# EAGLE schematic BT60-Test-jig (EAGLE 9.6.2)
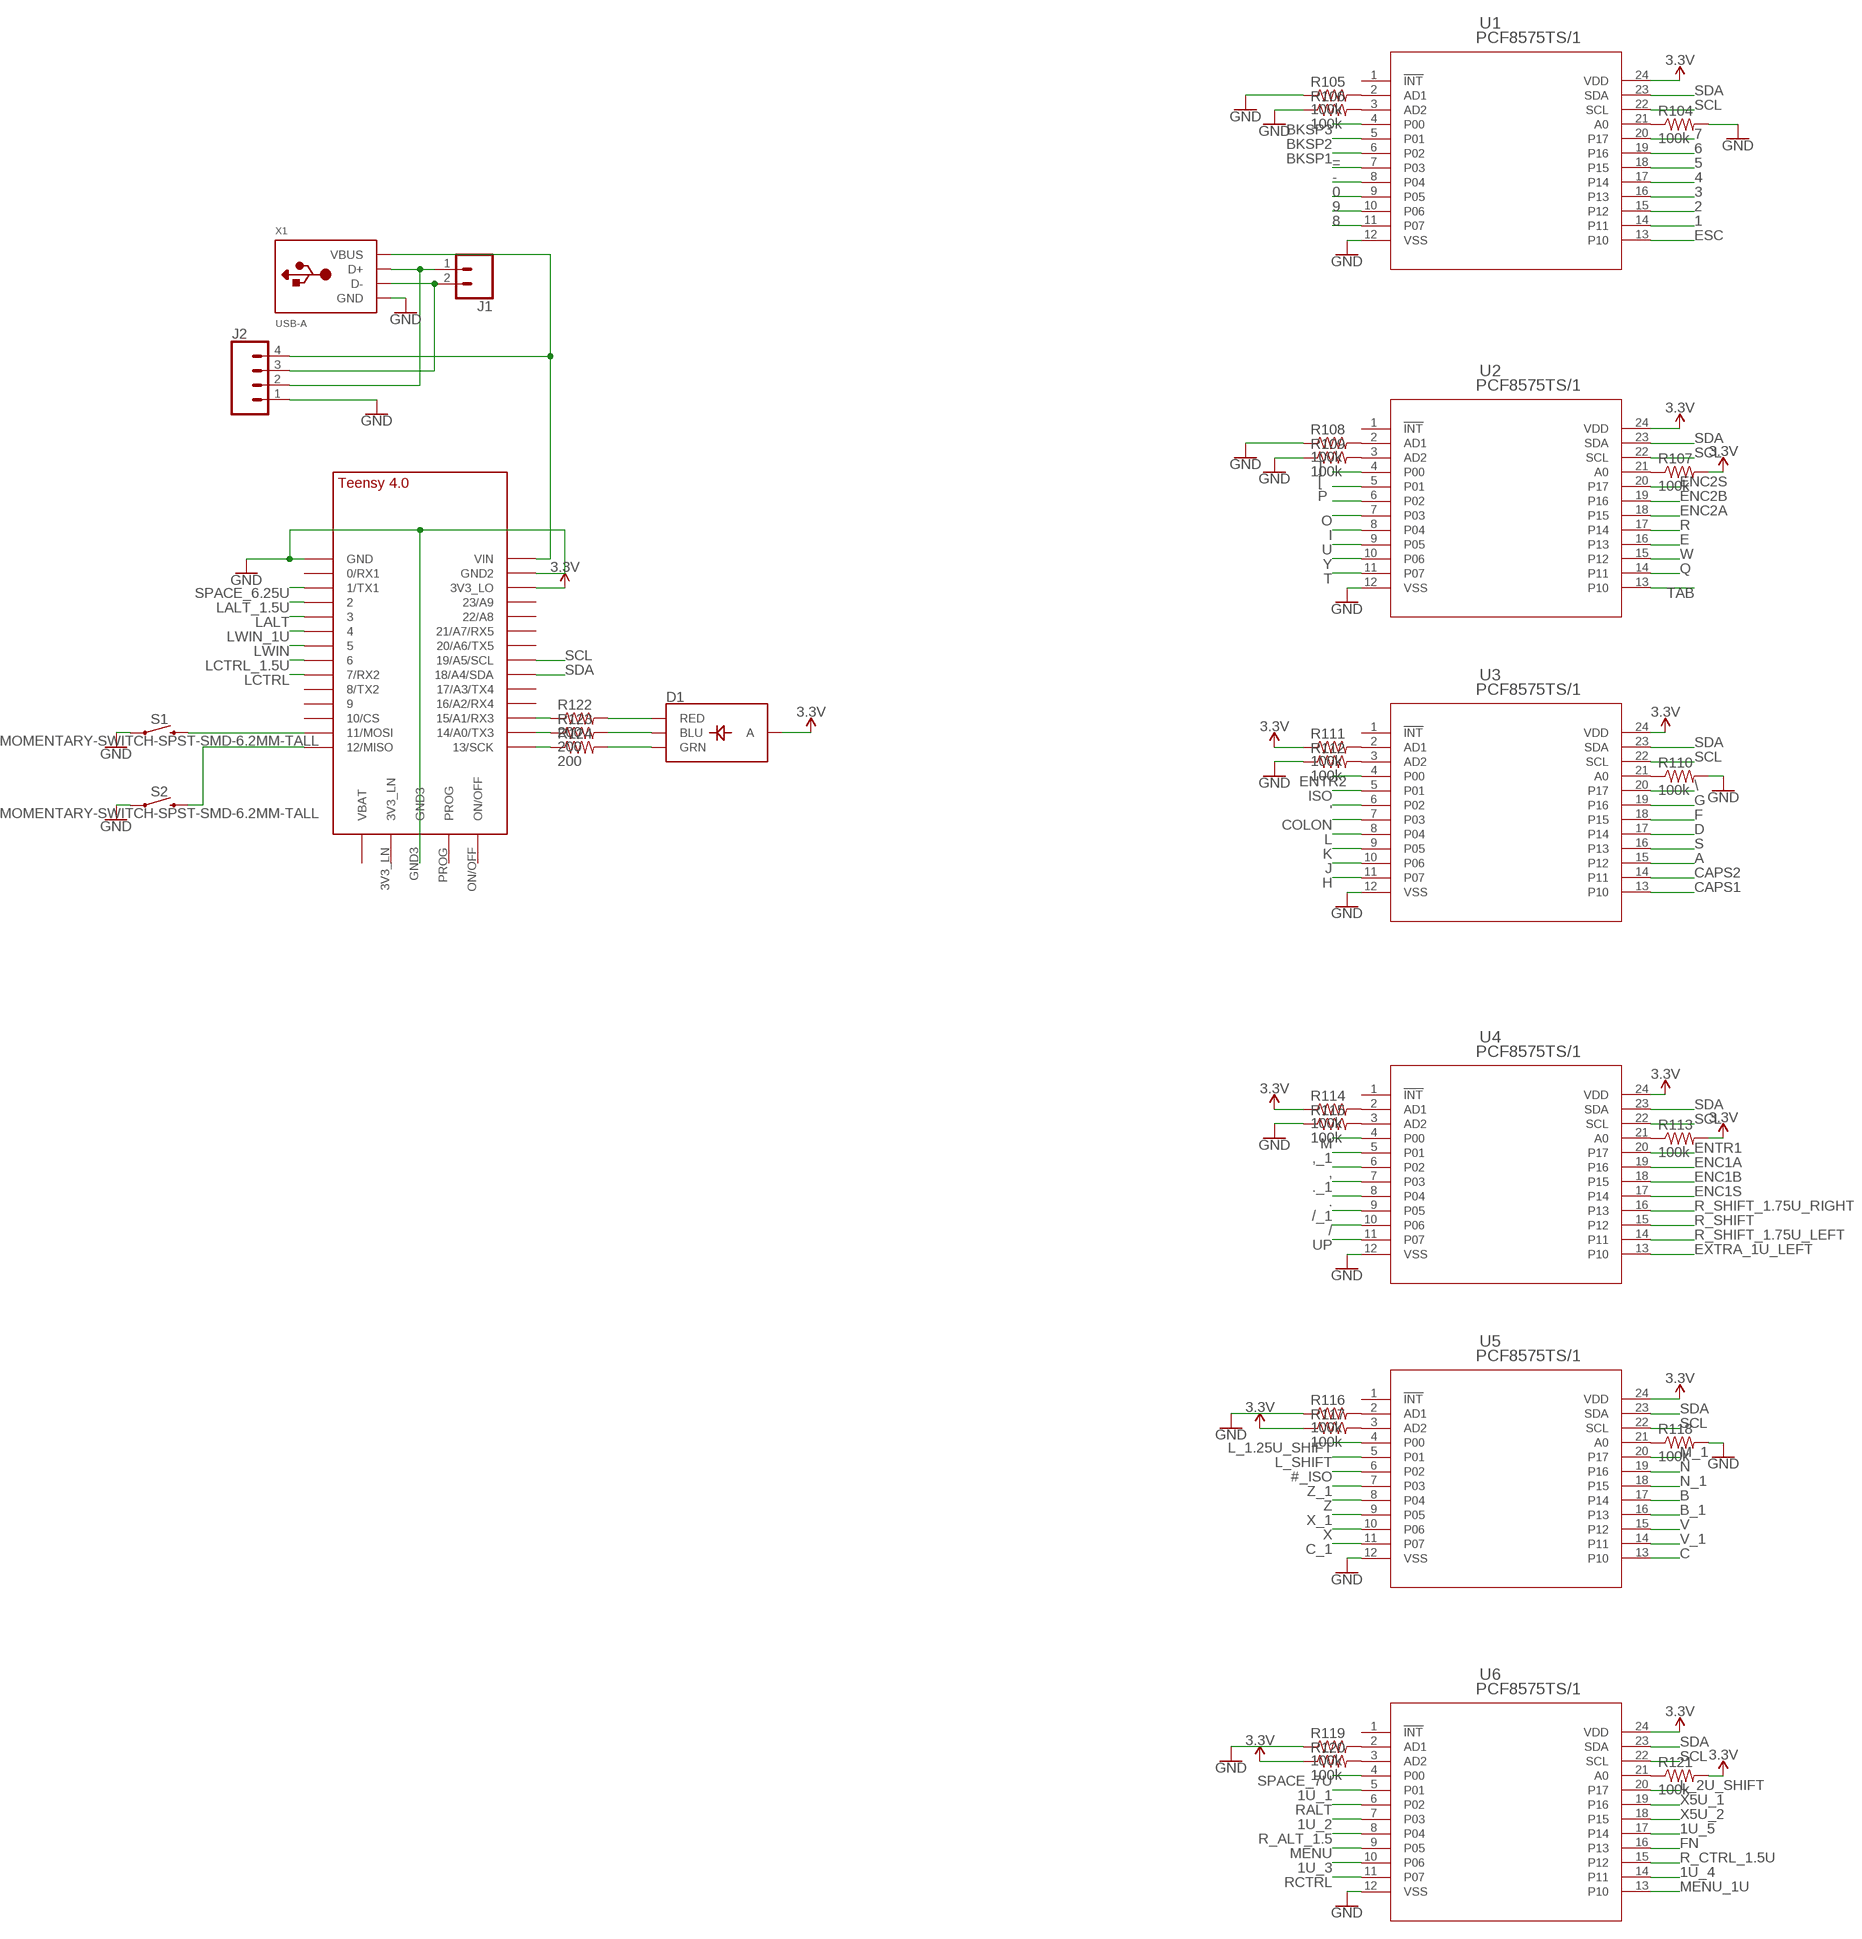
[diagram p0: schematic, sheet 1, part 1 of 2]
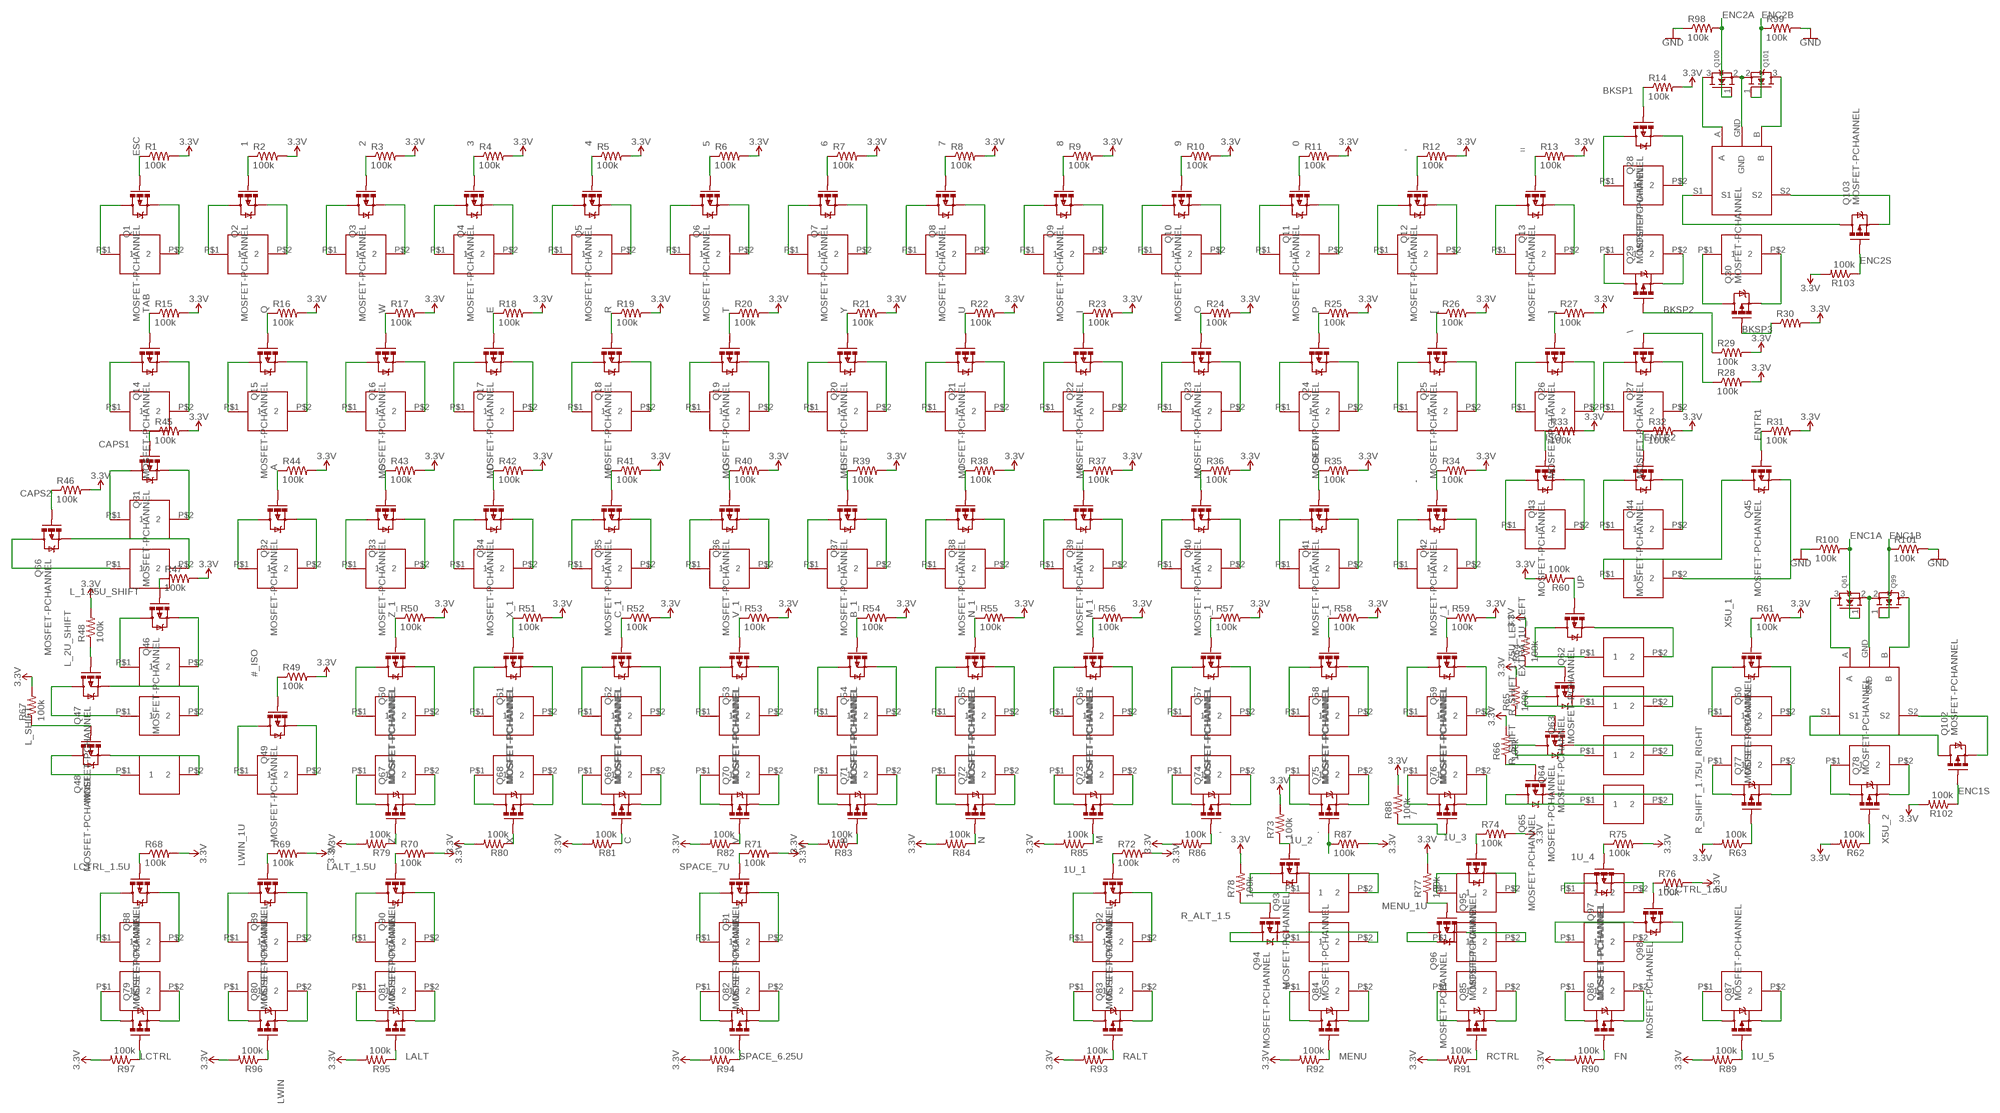
[diagram p1: schematic, sheet 1, part 2 of 2]

## Parts
0  CHERRY-SOLDERCHERRY-TEST  [CHERRY-TEST]
1  CHERRY-SOLDERCHERRY-TEST  [CHERRY-TEST]
1U_1  CHERRY-SOLDERCHERRY-TEST  [CHERRY-TEST]
1U_2  CHERRY-SOLDERCHERRY-TEST  [CHERRY-TEST]
1U_3  CHERRY-SOLDERCHERRY-TEST  [CHERRY-TEST]
1U_4  CHERRY-SOLDERCHERRY-TEST  [CHERRY-TEST]
1U_5  CHERRY-SOLDERCHERRY-TEST  [CHERRY-TEST]
2  CHERRY-SOLDERCHERRY-TEST  [CHERRY-TEST]
3  CHERRY-SOLDERCHERRY-TEST  [CHERRY-TEST]
4  CHERRY-SOLDERCHERRY-TEST  [CHERRY-TEST]
5  CHERRY-SOLDERCHERRY-TEST  [CHERRY-TEST]
6  CHERRY-SOLDERCHERRY-TEST  [CHERRY-TEST]
7  CHERRY-SOLDERCHERRY-TEST  [CHERRY-TEST]
8  CHERRY-SOLDERCHERRY-TEST  [CHERRY-TEST]
9  CHERRY-SOLDERCHERRY-TEST  [CHERRY-TEST]
#_ISO  CHERRY-SOLDERCHERRY-TEST  [CHERRY-TEST]
'  CHERRY-SOLDERCHERRY-TEST  [CHERRY-TEST]
,  CHERRY-SOLDERCHERRY-TEST  [CHERRY-TEST]
,_1  CHERRY-SOLDERCHERRY-TEST  [CHERRY-TEST]
-  CHERRY-SOLDERCHERRY-TEST  [CHERRY-TEST]
.  CHERRY-SOLDERCHERRY-TEST  [CHERRY-TEST]
._1  CHERRY-SOLDERCHERRY-TEST  [CHERRY-TEST]
/  CHERRY-SOLDERCHERRY-TEST  [CHERRY-TEST]
/_1  CHERRY-SOLDERCHERRY-TEST  [CHERRY-TEST]
=  CHERRY-SOLDERCHERRY-TEST  [CHERRY-TEST]
[  CHERRY-SOLDERCHERRY-TEST  [CHERRY-TEST]
\  CHERRY-SOLDERCHERRY-TEST  [CHERRY-TEST]
]  CHERRY-SOLDERCHERRY-TEST  [CHERRY-TEST]
A  CHERRY-SOLDERCHERRY-TEST  [CHERRY-TEST]
B  CHERRY-SOLDERCHERRY-TEST  [CHERRY-TEST]
B_1  CHERRY-SOLDERCHERRY-TEST  [CHERRY-TEST]
BS  CHERRY-SOLDERCHERRY-TEST  [CHERRY-TEST]
C  CHERRY-SOLDERCHERRY-TEST  [CHERRY-TEST]
C_1  CHERRY-SOLDERCHERRY-TEST  [CHERRY-TEST]
CAPS  CHERRY-SOLDERCHERRY-TEST  [CHERRY-TEST]
CAPS_STEP  CHERRY-SOLDERCHERRY-TEST  [CHERRY-TEST]
COLON  CHERRY-SOLDERCHERRY-TEST  [CHERRY-TEST]
D  CHERRY-SOLDERCHERRY-TEST  [CHERRY-TEST]
D1  LED-RGB-CASMD  [LED-TRICOLOR-SMD]
E  CHERRY-SOLDERCHERRY-TEST  [CHERRY-TEST]
ENTER  CHERRY-SOLDERCHERRY-TEST  [CHERRY-TEST]
ESC  CHERRY-SOLDERCHERRY-TEST  [CHERRY-TEST]
EXTRA_1U_LEFT  CHERRY-SOLDERCHERRY-TEST  [CHERRY-TEST]
F  CHERRY-SOLDERCHERRY-TEST  [CHERRY-TEST]
FN  CHERRY-SOLDERCHERRY-TEST  [CHERRY-TEST]
G  CHERRY-SOLDERCHERRY-TEST  [CHERRY-TEST]
H  CHERRY-SOLDERCHERRY-TEST  [CHERRY-TEST]
I  CHERRY-SOLDERCHERRY-TEST  [CHERRY-TEST]
ISO_#  CHERRY-SOLDERCHERRY-TEST  [CHERRY-TEST]
ISO_ENTER  CHERRY-SOLDERCHERRY-TEST  [CHERRY-TEST]
J  CHERRY-SOLDERCHERRY-TEST  [CHERRY-TEST]
J1  CONN_02  [1X02]
J2  CONN_041X04_NO_SILK  [1X04_NO_SILK]
K  CHERRY-SOLDERCHERRY-TEST  [CHERRY-TEST]
L  CHERRY-SOLDERCHERRY-TEST  [CHERRY-TEST]
L_1.25U_SHIFT  CHERRY-SOLDERCHERRY-TEST  [CHERRY-TEST]
L_2U_SHIFT  CHERRY-SOLDERCHERRY-TEST  [CHERRY-TEST]
L_SHIFT  CHERRY-SOLDERCHERRY-TEST  [CHERRY-TEST]
LALT  CHERRY-SOLDERCHERRY-TEST  [CHERRY-TEST]
LALT_1.5U  CHERRY-SOLDERCHERRY-TEST  [CHERRY-TEST]
LCTRL  CHERRY-SOLDERCHERRY-TEST  [CHERRY-TEST]
LCTRL_1.5U  CHERRY-SOLDERCHERRY-TEST  [CHERRY-TEST]
LWIN  CHERRY-SOLDERCHERRY-TEST  [CHERRY-TEST]
LWIN_1U  CHERRY-SOLDERCHERRY-TEST  [CHERRY-TEST]
M  CHERRY-SOLDERCHERRY-TEST  [CHERRY-TEST]
M_1  CHERRY-SOLDERCHERRY-TEST  [CHERRY-TEST]
MENU  CHERRY-SOLDERCHERRY-TEST  [CHERRY-TEST]
MENU_1U  CHERRY-SOLDERCHERRY-TEST  [CHERRY-TEST]
N  CHERRY-SOLDERCHERRY-TEST  [CHERRY-TEST]
N_1  CHERRY-SOLDERCHERRY-TEST  [CHERRY-TEST]
O  CHERRY-SOLDERCHERRY-TEST  [CHERRY-TEST]
P  CHERRY-SOLDERCHERRY-TEST  [CHERRY-TEST]
Q  CHERRY-SOLDERCHERRY-TEST  [CHERRY-TEST]
Q1  MOSFET-PCHANNEL  [SOT23-3]
Q2  MOSFET-PCHANNEL  [SOT23-3]
Q3  MOSFET-PCHANNEL  [SOT23-3]
Q4  MOSFET-PCHANNEL  [SOT23-3]
Q5  MOSFET-PCHANNEL  [SOT23-3]
Q6  MOSFET-PCHANNEL  [SOT23-3]
Q7  MOSFET-PCHANNEL  [SOT23-3]
Q8  MOSFET-PCHANNEL  [SOT23-3]
Q9  MOSFET-PCHANNEL  [SOT23-3]
Q10  MOSFET-PCHANNEL  [SOT23-3]
Q11  MOSFET-PCHANNEL  [SOT23-3]
Q12  MOSFET-PCHANNEL  [SOT23-3]
Q13  MOSFET-PCHANNEL  [SOT23-3]
Q14  MOSFET-PCHANNEL  [SOT23-3]
Q15  MOSFET-PCHANNEL  [SOT23-3]
Q16  MOSFET-PCHANNEL  [SOT23-3]
Q17  MOSFET-PCHANNEL  [SOT23-3]
Q18  MOSFET-PCHANNEL  [SOT23-3]
Q19  MOSFET-PCHANNEL  [SOT23-3]
Q20  MOSFET-PCHANNEL  [SOT23-3]
Q21  MOSFET-PCHANNEL  [SOT23-3]
Q22  MOSFET-PCHANNEL  [SOT23-3]
Q23  MOSFET-PCHANNEL  [SOT23-3]
Q24  MOSFET-PCHANNEL  [SOT23-3]
Q25  MOSFET-PCHANNEL  [SOT23-3]
Q26  MOSFET-PCHANNEL  [SOT23-3]
Q27  MOSFET-PCHANNEL  [SOT23-3]
Q28  MOSFET-PCHANNEL  [SOT23-3]
Q29  MOSFET-PCHANNEL  [SOT23-3]
Q30  MOSFET-PCHANNEL  [SOT23-3]
Q31  MOSFET-PCHANNEL  [SOT23-3]
Q32  MOSFET-PCHANNEL  [SOT23-3]
Q33  MOSFET-PCHANNEL  [SOT23-3]
Q34  MOSFET-PCHANNEL  [SOT23-3]
Q35  MOSFET-PCHANNEL  [SOT23-3]
Q36  MOSFET-PCHANNEL  [SOT23-3]
Q37  MOSFET-PCHANNEL  [SOT23-3]
Q38  MOSFET-PCHANNEL  [SOT23-3]
Q39  MOSFET-PCHANNEL  [SOT23-3]
Q40  MOSFET-PCHANNEL  [SOT23-3]
Q41  MOSFET-PCHANNEL  [SOT23-3]
Q42  MOSFET-PCHANNEL  [SOT23-3]
Q43  MOSFET-PCHANNEL  [SOT23-3]
Q44  MOSFET-PCHANNEL  [SOT23-3]
Q45  MOSFET-PCHANNEL  [SOT23-3]
Q46  MOSFET-PCHANNEL  [SOT23-3]
Q47  MOSFET-PCHANNEL  [SOT23-3]
Q48  MOSFET-PCHANNEL  [SOT23-3]
Q49  MOSFET-PCHANNEL  [SOT23-3]
Q50  MOSFET-PCHANNEL  [SOT23-3]
Q51  MOSFET-PCHANNEL  [SOT23-3]
Q52  MOSFET-PCHANNEL  [SOT23-3]
Q53  MOSFET-PCHANNEL  [SOT23-3]
Q54  MOSFET-PCHANNEL  [SOT23-3]
Q55  MOSFET-PCHANNEL  [SOT23-3]
Q56  MOSFET-PCHANNEL  [SOT23-3]
Q57  MOSFET-PCHANNEL  [SOT23-3]
Q58  MOSFET-PCHANNEL  [SOT23-3]
Q59  MOSFET-PCHANNEL  [SOT23-3]
Q60  MOSFET-PCHANNEL  [SOT23-3]
Q61  MOSFET-NREFLOW  [SOT23]
Q62  MOSFET-PCHANNEL  [SOT23-3]
Q63  MOSFET-PCHANNEL  [SOT23-3]
Q64  MOSFET-PCHANNEL  [SOT23-3]
Q65  MOSFET-PCHANNEL  [SOT23-3]
Q66  MOSFET-PCHANNEL  [SOT23-3]
Q67  MOSFET-PCHANNEL  [SOT23-3]
Q68  MOSFET-PCHANNEL  [SOT23-3]
Q69  MOSFET-PCHANNEL  [SOT23-3]
Q70  MOSFET-PCHANNEL  [SOT23-3]
Q71  MOSFET-PCHANNEL  [SOT23-3]
Q72  MOSFET-PCHANNEL  [SOT23-3]
Q73  MOSFET-PCHANNEL  [SOT23-3]
Q74  MOSFET-PCHANNEL  [SOT23-3]
Q75  MOSFET-PCHANNEL  [SOT23-3]
Q76  MOSFET-PCHANNEL  [SOT23-3]
Q77  MOSFET-PCHANNEL  [SOT23-3]
Q78  MOSFET-PCHANNEL  [SOT23-3]
Q79  MOSFET-PCHANNEL  [SOT23-3]
Q80  MOSFET-PCHANNEL  [SOT23-3]
Q81  MOSFET-PCHANNEL  [SOT23-3]
Q82  MOSFET-PCHANNEL  [SOT23-3]
Q83  MOSFET-PCHANNEL  [SOT23-3]
Q84  MOSFET-PCHANNEL  [SOT23-3]
Q85  MOSFET-PCHANNEL  [SOT23-3]
Q86  MOSFET-PCHANNEL  [SOT23-3]
Q87  MOSFET-PCHANNEL  [SOT23-3]
Q88  MOSFET-PCHANNEL  [SOT23-3]
Q89  MOSFET-PCHANNEL  [SOT23-3]
Q90  MOSFET-PCHANNEL  [SOT23-3]
Q91  MOSFET-PCHANNEL  [SOT23-3]
Q92  MOSFET-PCHANNEL  [SOT23-3]
Q93  MOSFET-PCHANNEL  [SOT23-3]
Q94  MOSFET-PCHANNEL  [SOT23-3]
Q95  MOSFET-PCHANNEL  [SOT23-3]
Q96  MOSFET-PCHANNEL  [SOT23-3]
Q97  MOSFET-PCHANNEL  [SOT23-3]
Q98  MOSFET-PCHANNEL  [SOT23-3]
Q99  MOSFET-NREFLOW  [SOT23]
Q100  MOSFET-NREFLOW  [SOT23]
Q101  MOSFET-NREFLOW  [SOT23]
Q102  MOSFET-PCHANNEL  [SOT23-3]
Q103  MOSFET-PCHANNEL  [SOT23-3]
R  CHERRY-SOLDERCHERRY-TEST  [CHERRY-TEST]
R1  100k  R0603  [0603-R]
R2  100k  R0603  [0603-R]
R3  100k  R0603  [0603-R]
R4  100k  R0603  [0603-R]
R5  100k  R0603  [0603-R]
R6  100k  R0603  [0603-R]
R7  100k  R0603  [0603-R]
R8  100k  R0603  [0603-R]
R9  100k  R0603  [0603-R]
R10  100k  R0603  [0603-R]
R11  100k  R0603  [0603-R]
R12  100k  R0603  [0603-R]
R13  100k  R0603  [0603-R]
R14  100k  R0603  [0603-R]
R15  100k  R0603  [0603-R]
R16  100k  R0603  [0603-R]
R17  100k  R0603  [0603-R]
R18  100k  R0603  [0603-R]
R19  100k  R0603  [0603-R]
R20  100k  R0603  [0603-R]
R21  100k  R0603  [0603-R]
R22  100k  R0603  [0603-R]
R23  100k  R0603  [0603-R]
R24  100k  R0603  [0603-R]
R25  100k  R0603  [0603-R]
R26  100k  R0603  [0603-R]
R27  100k  R0603  [0603-R]
R28  100k  R0603  [0603-R]
R29  100k  R0603  [0603-R]
R30  100k  R0603  [0603-R]
R31  100k  R0603  [0603-R]
R32  100k  R0603  [0603-R]
R33  100k  R0603  [0603-R]
R34  100k  R0603  [0603-R]
R35  100k  R0603  [0603-R]
R36  100k  R0603  [0603-R]
R37  100k  R0603  [0603-R]
R38  100k  R0603  [0603-R]
R39  100k  R0603  [0603-R]
R40  100k  R0603  [0603-R]
R41  100k  R0603  [0603-R]
R42  100k  R0603  [0603-R]
R43  100k  R0603  [0603-R]
R44  100k  R0603  [0603-R]
R45  100k  R0603  [0603-R]
R46  100k  R0603  [0603-R]
R47  100k  R0603  [0603-R]
R48  100k  R0603  [0603-R]
R49  100k  R0603  [0603-R]
R50  100k  R0603  [0603-R]
R51  100k  R0603  [0603-R]
R52  100k  R0603  [0603-R]
R53  100k  R0603  [0603-R]
R54  100k  R0603  [0603-R]
R55  100k  R0603  [0603-R]
R56  100k  R0603  [0603-R]
R57  100k  R0603  [0603-R]
R58  100k  R0603  [0603-R]
R59  100k  R0603  [0603-R]
R60  100k  R0603  [0603-R]
R61  100k  R0603  [0603-R]
R62  100k  R0603  [0603-R]
R63  100k  R0603  [0603-R]
R64  100k  R0603  [0603-R]
R65  100k  R0603  [0603-R]
R66  100k  R0603  [0603-R]
R67  100k  R0603  [0603-R]
R68  100k  R0603  [0603-R]
R69  100k  R0603  [0603-R]
R70  100k  R0603  [0603-R]
R71  100k  R0603  [0603-R]
R72  100k  R0603  [0603-R]
R73  100k  R0603  [0603-R]
R74  100k  R0603  [0603-R]
R75  100k  R0603  [0603-R]
R76  100k  R0603  [0603-R]
R77  100k  R0603  [0603-R]
R78  100k  R0603  [0603-R]
R79  100k  R0603  [0603-R]
R80  100k  R0603  [0603-R]
R81  100k  R0603  [0603-R]
R82  100k  R0603  [0603-R]
R83  100k  R0603  [0603-R]
R84  100k  R0603  [0603-R]
R85  100k  R0603  [0603-R]
R86  100k  R0603  [0603-R]
R87  100k  R0603  [0603-R]
R88  100k  R0603  [0603-R]
R89  100k  R0603  [0603-R]
R90  100k  R0603  [0603-R]
R91  100k  R0603  [0603-R]
R92  100k  R0603  [0603-R]
R93  100k  R0603  [0603-R]
R94  100k  R0603  [0603-R]
R95  100k  R0603  [0603-R]
R96  100k  R0603  [0603-R]
R97  100k  R0603  [0603-R]
R98  100k  R0603  [0603-R]
R99  100k  R0603  [0603-R]
R100  100k  R0603  [0603-R]
R101  100k  R0603  [0603-R]
R102  100k  R0603  [0603-R]
R103  100k  R0603  [0603-R]
R104  100k  R0603  [0603-R]
R105  100k  R0603  [0603-R]
R106  100k  R0603  [0603-R]
R107  100k  R0603  [0603-R]
R108  100k  R0603  [0603-R]
R109  100k  R0603  [0603-R]
R110  100k  R0603  [0603-R]
R111  100k  R0603  [0603-R]
R112  100k  R0603  [0603-R]
R113  100k  R0603  [0603-R]
R114  100k  R0603  [0603-R]
R115  100k  R0603  [0603-R]
R116  100k  R0603  [0603-R]
R117  100k  R0603  [0603-R]
R118  100k  R0603  [0603-R]
R119  100k  R0603  [0603-R]
R120  100k  R0603  [0603-R]
R121  100k  R0603  [0603-R]
R122  200  R0603  [0603-R]
R123  200  R0603  [0603-R]
R124  200  R0603  [0603-R]
R_ALT_1.5  CHERRY-SOLDERCHERRY-TEST  [CHERRY-TEST]
R_CTRL_1.5U  CHERRY-SOLDERCHERRY-TEST  [CHERRY-TEST]
R_SHIFT  CHERRY-SOLDERCHERRY-TEST  [CHERRY-TEST]
R_SHIFT_1.75U_LEFT  CHERRY-SOLDERCHERRY-TEST  [CHERRY-TEST]
R_SHIFT_1.75U_RIGHT  CHERRY-SOLDERCHERRY-TEST  [CHERRY-TEST]
RALT  CHERRY-SOLDERCHERRY-TEST  [CHERRY-TEST]
RCTRL  CHERRY-SOLDERCHERRY-TEST  [CHERRY-TEST]
S  CHERRY-SOLDERCHERRY-TEST  [CHERRY-TEST]
S1  MOMENTARY-SWITCH-SPST-SMD-6.2MM-TALL  [TACTILE_SWITCH_SMD_6.2MM_TALL]
S2  MOMENTARY-SWITCH-SPST-SMD-6.2MM-TALL  [TACTILE_SWITCH_SMD_6.2MM_TALL]
SPACE_6.25U  CHERRY-SOLDERCHERRY-TEST  [CHERRY-TEST]
SPACE_7U  CHERRY-SOLDERCHERRY-TEST  [CHERRY-TEST]
SPLIT_BS_1  CHERRY-SOLDERCHERRY-TEST  [CHERRY-TEST]
SPLIT_BS_2  CHERRY-SOLDERCHERRY-TEST  [CHERRY-TEST]
T  CHERRY-SOLDERCHERRY-TEST  [CHERRY-TEST]
TAB  CHERRY-SOLDERCHERRY-TEST  [CHERRY-TEST]
U  CHERRY-SOLDERCHERRY-TEST  [CHERRY-TEST]
U1  PCF8575TS/1  [SOT340-1_NXP]
U2  PCF8575TS/1  [SOT340-1_NXP]
U3  PCF8575TS/1  [SOT340-1_NXP]
U4  PCF8575TS/1  [SOT340-1_NXP]
U5  PCF8575TS/1  [SOT340-1_NXP]
U6  PCF8575TS/1  [SOT340-1_NXP]
U$1  ENCODER  [ENCODER]
U$2  TEENSY_4.0  [TEENSY_4.0]
U$3  ENCODER  [ENCODER]
UP  CHERRY-SOLDERCHERRY-TEST  [CHERRY-TEST]
V  CHERRY-SOLDERCHERRY-TEST  [CHERRY-TEST]
V_1  CHERRY-SOLDERCHERRY-TEST  [CHERRY-TEST]
W  CHERRY-SOLDERCHERRY-TEST  [CHERRY-TEST]
X  CHERRY-SOLDERCHERRY-TEST  [CHERRY-TEST]
X1  USB-A  [MOLEX_480371000]
X5U_1  CHERRY-SOLDERCHERRY-TEST  [CHERRY-TEST]
X5U_2  CHERRY-SOLDERCHERRY-TEST  [CHERRY-TEST]
X_1  CHERRY-SOLDERCHERRY-TEST  [CHERRY-TEST]
Y  CHERRY-SOLDERCHERRY-TEST  [CHERRY-TEST]
Z  CHERRY-SOLDERCHERRY-TEST  [CHERRY-TEST]
Z_1  CHERRY-SOLDERCHERRY-TEST  [CHERRY-TEST]

## Nets
0: Q11.1(G) R11.1 U1.9(P05)
1: Q2.1(G) R2.1 U1.14(P11)
1U_1: Q92.1(G) R72.1 U6.5(P01)
1U_2: Q93.1(G) R73.1 U6.7(P03)
1U_3: Q95.1(G) R74.1 U6.10(P06)
1U_4: Q97.1(G) R75.1 U6.14(P11)
1U_5: Q87.1(G) R89.1 U6.17(P14)
2: Q3.1(G) R3.1 U1.15(P12)
3: Q4.1(G) R4.1 U1.16(P13)
3.3V: D1.A R1.2 R2.2 R3.2 R4.2 R5.2 R6.2 R7.2 R8.2 R9.2 R10.2 R11.2 R12.2 R13.2 R14.2 R15.2 R16.2 R17.2 R18.2 R19.2 R20.2 R21.2 R22.2 R23.2 R24.2 R25.2 R26.2 R27.2 R28.2 R29.2 R30.2 R31.2 R32.2 R33.2 R34.2 R35.2 R36.2 R37.2 R38.2 R39.2 R40.2 R41.2 R42.2 R43.2 R44.2 R45.2 R46.2 R47.2 R48.2 R49.2 R50.2 R51.2 R52.2 R53.2 R54.2 R55.2 R56.2 R57.2 R58.2 R59.2 R60.2 R61.2 R62.2 R63.2 R64.2 R65.2 R66.2 R67.2 R68.2 R69.2 R70.2 R71.2 R72.2 R73.2 R74.2 R75.2 R76.2 R77.2 R78.2 R79.2 R80.2 R81.2 R82.2 R83.2 R84.2 R85.2 R86.2 R87.2 R88.2 R89.2 R90.2 R91.2 R92.2 R93.2 R94.2 R95.2 R96.2 R97.2 R102.2 R103.2 R107.2 R111.1 R113.2 R114.1 R117.1 R120.1 R121.2 U1.24(VDD) U2.24(VDD) U3.24(VDD) U4.24(VDD) U5.24(VDD) U6.24(VDD) U$2.3V3_LO
4: Q5.1(G) R5.1 U1.17(P14)
5: Q6.1(G) R6.1 U1.18(P15)
6: Q7.1(G) R7.1 U1.19(P16)
7: Q8.1(G) R8.1 U1.20(P17)
8: Q9.1(G) R9.1 U1.11(P07)
9: Q10.1(G) R10.1 U1.10(P06)
#_ISO: Q49.1(G) R49.1 U5.6(P02)
': Q42.1(G) R34.1 U3.6(P02)
,: Q74.1(G) R86.1 U4.6(P02)
,_1: Q57.1(G) R57.1 U4.5(P01)
-: Q12.1(G) R12.1 U1.8(P04)
.: Q75.1(G) R87.1 U4.8(P04)
._1: Q58.1(G) R58.1 U4.7(P03)
/: Q76.1(G) R88.1 U4.10(P06)
/_1: Q59.1(G) R59.1 U4.9(P05)
=: Q13.1(G) R13.1 U1.7(P03)
[: Q25.1(G) R26.1 U2.5(P01)
\: Q27.1(G) R28.1 U3.20(P17)
]: Q26.1(G) R27.1 U2.4(P00)
A: Q32.1(G) R44.1 U3.15(P12)
B: Q71.1(G) R83.1 U5.17(P14)
B_1: Q54.1(G) R54.1 U5.16(P13)
BKSP1: Q28.1(G) R14.1 U1.6(P02)
BKSP2: Q29.1(G) R29.1 U1.5(P01)
BKSP3: Q30.1(G) R30.1 U1.4(P00)
C: Q69.1(G) R81.1 U5.13(P10)
C_1: Q52.1(G) R52.1 U5.11(P07)
CAPS1: Q31.1(G) R45.1 U3.13(P10)
CAPS2: Q66.1(G) R46.1 U3.14(P11)
COLON: Q41.1(G) R35.1 U3.7(P03)
D: Q34.1(G) R42.1 U3.17(P14)
E: Q17.1(G) R18.1 U2.16(P13)
ENC1A: Q61.1(G) R100.2 U4.19(P16)
ENC1B: Q99.1(G) R101.1 U4.18(P15)
ENC1S: Q102.1(G) R102.1 U4.17(P14)
ENC2A: Q100.1(G) R98.2 U2.18(P15)
ENC2B: Q101.1(G) R99.1 U2.19(P16)
ENC2S: Q103.1(G) R103.1 U2.20(P17)
ENTR1: Q45.1(G) R31.1 U4.20(P17)
ENTR2: Q44.1(G) R32.1 U3.4(P00)
ESC: Q1.1(G) R1.1 U1.13(P10)
EXTRA_1U_LEFT: Q63.1(G) R64.1 U4.13(P10)
F: Q35.1(G) R41.1 U3.18(P15)
FN: Q86.1(G) R90.1 U6.16(P13)
G: Q36.1(G) R40.1 U3.19(P16)
GND: J2.1 R98.1 R99.2 R100.1 R101.2 R104.2 R105.1 R106.1 R108.1 R109.1 R110.2 R112.1 R115.1 R116.1 R118.2 R119.1 S1.A2 S2.A2 U1.12(VSS) U2.12(VSS) U3.12(VSS) U4.12(VSS) U5.12(VSS) U6.12(VSS) U$2.GND U$2.GND2 U$2.GND3 X1.4(GND)
H: Q37.1(G) R39.1 U3.11(P07)
I: Q22.1(G) R23.1 U2.8(P04)
ISO: Q43.1(G) R33.1 U3.5(P01)
J: Q38.1(G) R38.1 U3.10(P06)
K: Q39.1(G) R37.1 U3.9(P05)
L: Q40.1(G) R36.1 U3.8(P04)
L_1.25U_SHIFT: Q46.1(G) R47.1 U5.4(P00)
L_2U_SHIFT: Q47.1(G) R48.1 U6.20(P17)
L_SHIFT: Q48.1(G) R67.1 U5.5(P01)
LALT: Q81.1(G) R95.1 U$2.3/CANTX
LALT_1.5U: Q90.1(G) R70.1 U$2.2
LCTRL: Q79.1(G) R97.1 U$2.7(7/RX2)
LCTRL_1.5U: Q88.1(G) R68.1 U$2.6
LWIN: Q80.1(G) R96.1 U$2.5
LWIN_1U: Q89.1(G) R69.1 U$2.4/CANRX
M: Q73.1(G) R85.1 U4.4(P00)
M_1: Q56.1(G) R56.1 U5.20(P17)
MENU: Q84.1(G) R92.1 U6.9(P05)
MENU_1U: Q96.1(G) R77.1 U6.13(P10)
N: Q72.1(G) R84.1 U5.19(P16)
N$1: ESC.P$1 Q1.3(D)
N$2: ESC.P$2 Q1.2(S)
N$3: 1.P$1 Q2.3(D)
N$4: 1.P$2 Q2.2(S)
N$5: 2.P$1 Q3.3(D)
N$6: 2.P$2 Q3.2(S)
N$7: 3.P$1 Q4.3(D)
N$8: 3.P$2 Q4.2(S)
N$9: 4.P$1 Q5.3(D)
N$10: 4.P$2 Q5.2(S)
N$11: 5.P$1 Q6.3(D)
N$12: 5.P$2 Q6.2(S)
N$13: 6.P$1 Q7.3(D)
N$14: 6.P$2 Q7.2(S)
N$15: 7.P$1 Q8.3(D)
N$16: 7.P$2 Q8.2(S)
N$17: 8.P$1 Q9.3(D)
N$18: 8.P$2 Q9.2(S)
N$19: 9.P$1 Q10.3(D)
N$20: 9.P$2 Q10.2(S)
N$21: 0.P$1 Q11.3(D)
N$22: 0.P$2 Q11.2(S)
N$23: -.P$1 Q12.3(D)
N$24: -.P$2 Q12.2(S)
N$25: =.P$1 Q13.3(D)
N$26: =.P$2 Q13.2(S)
N$27: Q14.3(D) TAB.P$1
N$28: Q14.2(S) TAB.P$2
N$29: Q15.3(D) Q.P$1
N$30: Q15.2(S) Q.P$2
N$31: Q16.3(D) W.P$1
N$32: Q16.2(S) W.P$2
N$33: E.P$1 Q17.3(D)
N$34: E.P$2 Q17.2(S)
N$35: Q18.3(D) R.P$1
N$36: Q18.2(S) R.P$2
N$37: Q19.3(D) T.P$1
N$38: Q19.2(S) T.P$2
N$39: Q20.3(D) Y.P$1
N$40: Q20.2(S) Y.P$2
N$41: Q21.3(D) U.P$1
N$42: Q21.2(S) U.P$2
N$43: I.P$1 Q22.3(D)
N$44: I.P$2 Q22.2(S)
N$45: O.P$1 Q23.3(D)
N$46: O.P$2 Q23.2(S)
N$47: P.P$1 Q24.3(D)
N$48: P.P$2 Q24.2(S)
N$49: [.P$1 Q25.3(D)
N$50: [.P$2 Q25.2(S)
N$51: ].P$1 Q26.3(D)
N$52: ].P$2 Q26.2(S)
N$53: \.P$1 Q27.3(D)
N$54: \.P$2 Q27.2(S)
N$55: Q28.3(D) SPLIT_BS_1.P$1
N$56: Q28.2(S) SPLIT_BS_1.P$2
N$57: BS.P$2 Q29.2(S)
N$58: BS.P$1 Q29.3(D)
N$59: Q30.2(S) SPLIT_BS_2.P$2
N$60: Q30.3(D) SPLIT_BS_2.P$1
N$61: CAPS_STEP.P$1 Q31.3(D)
N$62: CAPS_STEP.P$2 Q31.2(S)
N$63: A.P$1 Q32.3(D)
N$64: A.P$2 Q32.2(S)
N$65: Q33.3(D) S.P$1
N$66: Q33.2(S) S.P$2
N$67: D.P$1 Q34.3(D)
N$68: D.P$2 Q34.2(S)
N$69: F.P$1 Q35.3(D)
N$70: F.P$2 Q35.2(S)
N$71: G.P$1 Q36.3(D)
N$72: G.P$2 Q36.2(S)
N$73: H.P$1 Q37.3(D)
N$74: H.P$2 Q37.2(S)
N$75: J.P$1 Q38.3(D)
N$76: J.P$2 Q38.2(S)
N$77: K.P$1 Q39.3(D)
N$78: K.P$2 Q39.2(S)
N$79: L.P$1 Q40.3(D)
N$80: L.P$2 Q40.2(S)
N$81: COLON.P$1 Q41.3(D)
N$82: COLON.P$2 Q41.2(S)
N$83: '.P$1 Q42.3(D)
N$84: '.P$2 Q42.2(S)
N$85: ISO_#.P$1 Q43.3(D)
N$86: ISO_#.P$2 Q43.2(S)
N$87: ISO_ENTER.P$1 Q44.3(D)
N$88: ISO_ENTER.P$2 Q44.2(S)
N$89: ENTER.P$1 Q45.3(D)
N$90: ENTER.P$2 Q45.2(S)
N$91: L_1.25U_SHIFT.P$1 Q46.3(D)
N$92: L_1.25U_SHIFT.P$2 Q46.2(S)
N$93: L_2U_SHIFT.P$1 Q47.3(D)
N$94: L_2U_SHIFT.P$2 Q47.2(S)
N$95: L_SHIFT.P$1 Q48.3(D)
N$96: L_SHIFT.P$2 Q48.2(S)
N$97: #_ISO.P$1 Q49.3(D)
N$98: #_ISO.P$2 Q49.2(S)
N$99: Q50.3(D) Z_1.P$1
N$100: Q50.2(S) Z_1.P$2
N$101: Q51.3(D) X_1.P$1
N$102: Q51.2(S) X_1.P$2
N$103: C_1.P$1 Q52.3(D)
N$104: C_1.P$2 Q52.2(S)
N$105: Q53.3(D) V_1.P$1
N$106: Q53.2(S) V_1.P$2
N$107: B_1.P$1 Q54.3(D)
N$108: B_1.P$2 Q54.2(S)
N$109: N_1.P$1 Q55.3(D)
N$110: N_1.P$2 Q55.2(S)
N$111: M_1.P$1 Q56.3(D)
N$112: M_1.P$2 Q56.2(S)
N$113: ,_1.P$1 Q57.3(D)
N$114: ,_1.P$2 Q57.2(S)
N$115: ._1.P$1 Q58.3(D)
N$116: ._1.P$2 Q58.2(S)
N$117: /_1.P$1 Q59.3(D)
N$118: /_1.P$2 Q59.2(S)
N$119: Q60.3(D) X5U_1.P$1
N$120: Q60.2(S) X5U_1.P$2
N$121: Q61.2(S) Q99.2(S) U$3.GND
N$122: Q61.3(D) U$3.A
N$123: Q62.3(D) UP.P$1
N$124: Q62.2(S) UP.P$2
N$125: EXTRA_1U_LEFT.P$1 Q63.3(D)
N$126: EXTRA_1U_LEFT.P$2 Q63.2(S)
N$127: Q64.3(D) R_SHIFT_1.75U_LEFT.P$1
N$128: Q64.2(S) R_SHIFT_1.75U_LEFT.P$2
N$129: Q65.3(D) R_SHIFT.P$1
N$130: Q65.2(S) R_SHIFT.P$2
N$131: CAPS.P$1 Q66.3(D)
N$132: CAPS.P$2 Q66.2(S)
N$133: Q67.2(S) Z.P$2
N$134: Q67.3(D) Z.P$1
N$135: Q68.2(S) X.P$2
N$136: Q68.3(D) X.P$1
N$137: C.P$2 Q69.2(S)
N$138: C.P$1 Q69.3(D)
N$139: Q70.2(S) V.P$2
N$140: Q70.3(D) V.P$1
N$141: B.P$2 Q71.2(S)
N$142: B.P$1 Q71.3(D)
N$143: N.P$2 Q72.2(S)
N$144: N.P$1 Q72.3(D)
N$145: M.P$2 Q73.2(S)
N$146: M.P$1 Q73.3(D)
N$147: ,.P$2 Q74.2(S)
N$148: ,.P$1 Q74.3(D)
N$149: ..P$2 Q75.2(S)
N$150: ..P$1 Q75.3(D)
N$151: /.P$2 Q76.2(S)
N$152: /.P$1 Q76.3(D)
N$153: Q77.2(S) R_SHIFT_1.75U_RIGHT.P$2
N$154: Q77.3(D) R_SHIFT_1.75U_RIGHT.P$1
N$155: Q78.2(S) X5U_2.P$2
N$156: Q78.3(D) X5U_2.P$1
N$157: LCTRL.P$2 Q79.2(S)
N$158: LCTRL.P$1 Q79.3(D)
N$159: LWIN.P$2 Q80.2(S)
N$160: LWIN.P$1 Q80.3(D)
N$161: LALT.P$2 Q81.2(S)
N$162: LALT.P$1 Q81.3(D)
N$163: Q82.2(S) SPACE_6.25U.P$2
N$164: Q82.3(D) SPACE_6.25U.P$1
N$165: Q83.2(S) RALT.P$2
N$166: Q83.3(D) RALT.P$1
N$167: MENU.P$2 Q84.2(S)
N$168: MENU.P$1 Q84.3(D)
N$169: Q85.2(S) RCTRL.P$2
N$170: Q85.3(D) RCTRL.P$1
N$171: FN.P$2 Q86.2(S)
N$172: FN.P$1 Q86.3(D)
N$173: 1U_5.P$2 Q87.2(S)
N$174: 1U_5.P$1 Q87.3(D)
N$175: LCTRL_1.5U.P$1 Q88.3(D)
N$176: LCTRL_1.5U.P$2 Q88.2(S)
N$177: LWIN_1U.P$1 Q89.3(D)
N$178: LWIN_1U.P$2 Q89.2(S)
N$179: LALT_1.5U.P$1 Q90.3(D)
N$180: LALT_1.5U.P$2 Q90.2(S)
N$181: Q91.3(D) SPACE_7U.P$1
N$182: Q91.2(S) SPACE_7U.P$2
N$183: 1U_1.P$1 Q92.3(D)
N$184: 1U_1.P$2 Q92.2(S)
N$185: 1U_2.P$1 Q93.3(D)
N$186: 1U_2.P$2 Q93.2(S)
N$187: Q94.3(D) R_ALT_1.5.P$1
N$188: Q94.2(S) R_ALT_1.5.P$2
N$189: 1U_3.P$1 Q95.3(D)
N$190: 1U_3.P$2 Q95.2(S)
N$191: MENU_1U.P$1 Q96.3(D)
N$192: MENU_1U.P$2 Q96.2(S)
N$193: 1U_4.P$1 Q97.3(D)
N$194: 1U_4.P$2 Q97.2(S)
N$195: Q98.3(D) R_CTRL_1.5U.P$1
N$196: Q98.2(S) R_CTRL_1.5U.P$2
N$197: Q99.3(D) U$3.B
N$198: Q100.2(S) Q101.2(S) U$1.GND
N$199: Q100.3(D) U$1.A
N$200: Q101.3(D) U$1.B
N$201: Q103.3(D) U$1.S1
N$202: Q103.2(S) U$1.S2
N$203: Q102.3(D) U$3.S1
N$204: Q102.2(S) U$3.S2
N$205: R104.1 U1.21(A0)
N$206: R105.2 U1.2(AD1)
N$207: R106.2 U1.3(AD2)
N$208: R107.1 U2.21(A0)
N$209: R108.2 U2.2(AD1)
N$210: R109.2 U2.3(AD2)
N$211: R111.2 U3.2(AD1)
N$212: R112.2 U3.3(AD2)
N$213: R110.1 U3.21(A0)
N$214: R113.1 U4.21(A0)
N$215: R114.2 U4.2(AD1)
N$216: R115.2 U4.3(AD2)
N$217: R116.2 U5.2(AD1)
N$218: R117.2 U5.3(AD2)
N$219: R118.1 U5.21(A0)
N$220: J2.4 U$2.VIN X1.1(VBUS)
N$221: J1.1 J2.2 X1.3(D+)
N$222: J1.2 J2.3 X1.2(D-)
N$223: D1.R(RED) R122.2
N$224: D1.B(BLU) R123.2
N$225: D1.G(GRN) R124.2
N$226: R124.1 U$2.13/SCK
N$227: R123.1 U$2.14/A0(14/A0/TX3)
N$228: R122.1 U$2.15/A1(15/A1/RX3)
N$229: S1.B2 U$2.11/MOSI
N$230: S2.B2 U$2.12/MISO
N$236: R119.2 U6.2(AD1)
N$237: R120.2 U6.3(AD2)
N$238: R121.1 U6.21(A0)
N_1: Q55.1(G) R55.1 U5.18(P15)
O: Q23.1(G) R24.1 U2.7(P03)
P: Q24.1(G) R25.1 U2.6(P02)
Q: Q15.1(G) R16.1 U2.14(P11)
R: Q18.1(G) R19.1 U2.17(P14)
R_ALT_1.5: Q94.1(G) R78.1 U6.8(P04)
R_CTRL_1.5U: Q98.1(G) R76.1 U6.15(P12)
R_SHIFT: Q65.1(G) R66.1 U4.15(P12)
R_SHIFT_1.75U_LEFT: Q64.1(G) R65.1 U4.14(P11)
R_SHIFT_1.75U_RIGHT: Q77.1(G) R63.1 U4.16(P13)
RALT: Q83.1(G) R93.1 U6.6(P02)
RCTRL: Q85.1(G) R91.1 U6.11(P07)
S: Q33.1(G) R43.1 U3.16(P13)
SCL: U1.22(SCL) U2.22(SCL) U3.22(SCL) U4.22(SCL) U5.22(SCL) U6.22(SCL) U$2.19/A5/SCL
SDA: U1.23(SDA) U2.23(SDA) U3.23(SDA) U4.23(SDA) U5.23(SDA) U6.23(SDA) U$2.18/A4/SDA
SPACE_6.25U: Q82.1(G) R94.1 U$2.1/TX(1/TX1)
SPACE_7U: Q91.1(G) R71.1 U6.4(P00)
T: Q19.1(G) R20.1 U2.11(P07)
TAB: Q14.1(G) R15.1 U2.13(P10)
U: Q21.1(G) R22.1 U2.9(P05)
UP: Q62.1(G) R60.1 U4.11(P07)
V: Q70.1(G) R82.1 U5.15(P12)
V_1: Q53.1(G) R53.1 U5.14(P11)
W: Q16.1(G) R17.1 U2.15(P12)
X: Q68.1(G) R80.1 U5.10(P06)
X5U_1: Q60.1(G) R61.1 U6.19(P16)
X5U_2: Q78.1(G) R62.1 U6.18(P15)
X_1: Q51.1(G) R51.1 U5.9(P05)
Y: Q20.1(G) R21.1 U2.10(P06)
Z: Q67.1(G) R79.1 U5.8(P04)
Z_1: Q50.1(G) R50.1 U5.7(P03)
Unconnected: U1.1(!INT) U2.1(!INT) U3.1(!INT) U4.1(!INT) U5.1(!INT) U6.1(!INT) U$2.0/RX(0/RX1) U$2.3V3_LN U$2.8(8/TX2) U$2.9/CS U$2.10/CS U$2.16/A2(16/A2/RX4) U$2.17/A3(17/A3/TX4) U$2.20/A6(20/A6/TX5) U$2.21/A7(21/A7/RX5) U$2.22/A8 U$2.23/A9 U$2.ON/OFF U$2.PROG U$2.VBAT\(VBAT)

## Library data of the parts
0 1 1U_1-1U_5 2-9 #_ISO ' , ,_1 - . ._1 / /_1 = [ \ ] A B B_1 BS C C_1 CAPS CAPS_STEP COLON D E ENTER ESC EXTRA_1U_LEFT F FN G H I ISO_# ISO_ENTER J K L L_1.25U_SHIFT L_2U_SHIFT L_SHIFT LALT LALT_1.5U LCTRL LCTRL_1.5U LWIN LWIN_1U M M_1 MENU MENU_1U N N_1 O P Q R R_ALT_1.5 R_CTRL_1.5U R_SHIFT R_SHIFT_1.75U_LEFT R_SHIFT_1.75U_RIGHT RALT RCTRL S SPACE_6.25U SPACE_7U SPLIT_BS_1 SPLIT_BS_2 T TAB U UP V V_1 W X X5U_1 X5U_2 X_1 Y Z Z_1 = Volume_V1:CHERRY-SOLDER
D1 = SparkFun-LED:LED-RGB-CA: LED-RGB Diffused Common Anode Packages: LED RGB-THRU P-LCC-4-3 LED-TRICOLOR-SMD SparkFun Products: RGB Diffused Common Anode- Diffuse <[https://www.sparkfun.com/products/10821]> RGB Diffused Common Anode - Clear <[https://www.sparkfun.com/products/10820]> Qduino Mini <[https://www.sparkfun.com/products/13614]> Triple Output LED RGB - SMD <https://www.sparkfun.com/products/7844>; PROD_ID: DIO-08324
J1 = SparkFun-Connectors:CONN_02: Multi connection point. Often used as Generic Header-pin footprint for 0.1 inch spaced/style header connections On any of the 0.1 inch spaced packages, you can populate with these: Break Away Headers - Straight <https://www.sparkfun.com/products/116> (PRT-00116) Break Away Male Headers - Right Angle <https://www.sparkfun.com/products/553> (PRT-00553) Female Headers <https://www.sparkfun.com/products/115> (PRT-00115) Break Away Headers - Machine Pin <https://www.sparkfun.com/products/117> (PRT-00117) Break Away Female Headers - Swiss Machine Pin <https://www.sparkfun.com/products/743> (PRT-00743) For SCREWTERMINALS and SPRING TERMINALS visit here: Screw Terimnals on SparkFun.com <https://www.sparkfun.com/search/results?term=Screw+Terminals> (5mm/3.5mm/2.54mm spacing) This device is also useful as a general connection point to wire up your design to another part of your project. Our various solder wires solder well into these plated through hole pads. Hook-Up Wire - Assortment (Stranded, 22 AWG) <https://www.sparkfun.com/products/11375> (PRT-11375) Hook-Up Wire - Assortment (Solid Core, 22 AWG) <https://www.sparkfun.com/products/11367> (PRT-11367) View the entire wire category on our website here <https://www.sparkfun.com/categories/141> Special notes: Molex polarized connector foot print use with: PRT-08233 with associated crimp pins and housings. 2.54_SCREWTERM for use with PRT-10571. 3.5mm Screw Terminal footprints for PRT-08084 5mm Screw Terminal footprints for use with PRT-08432
J2 = SparkFun-Connectors:CONN_04: Multi connection point. Often used as Generic Header-pin footprint for 0.1 inch spaced/style header connections On any of the 0.1 inch spaced packages, you can populate with these: Break Away Headers - Straight <https://www.sparkfun.com/products/116> (PRT-00116) Break Away Male Headers - Right Angle <https://www.sparkfun.com/products/553> (PRT-00553) Female Headers <https://www.sparkfun.com/products/115> (PRT-00115) Break Away Headers - Machine Pin <https://www.sparkfun.com/products/117> (PRT-00117) Break Away Female Headers - Swiss Machine Pin <https://www.sparkfun.com/products/743> (PRT-00743) For SCREWTERMINALS and SPRING TERMINALS visit here: Screw Terimnals on SparkFun.com <https://www.sparkfun.com/search/results?term=Screw+Terminals> (5mm/3.5mm/2.54mm spacing) This device is also useful as a general connection point to wire up your design to another part of your project. Our various solder wires solder well into these plated through hole pads. Hook-Up Wire - Assortment (Stranded, 22 AWG) <https://www.sparkfun.com/products/11375> (PRT-11375) Hook-Up Wire - Assortment (Solid Core, 22 AWG) <https://www.sparkfun.com/products/11367> (PRT-11367) View the entire wire category on our website here <https://www.sparkfun.com/categories/141> Special notes: Molex polarized connector foot print use with SKU : PRT-08231 with associated crimp pins and housings. 1MM SMD Version SKU: PRT-10208; PROD_ID: CONN-09696
Q1-Q60 Q62-Q98 Q102 Q103 = User-Submitted:MOSFET-PCHANNEL: Generic PMOSFET IRLML2244 - TRANS-11153 (SOT-23 -20V -4.3A) (1.Gate 2.Source 3.Drain) FQP27P06 - COM-10349 <http://www.sparkfun.com/products/10349> (TO-220 -60V -27A) (1.Gate 2.Source 3.Drain); PROD_ID: TRANS-08285
Q61 Q99-Q101 = adafruit:MOSFET-N: N-Channel Mosfet 2N7002E - 60V 260mA SOT23 [Digikey: 2N7002ET1GOSTR-ND] - REEL BSH103 - 30V 850mA SOT23 [Digikey: 568-5013-1-ND]
R1-R124 = comma.ai:R
S1 S2 = SparkFun-Switches:MOMENTARY-SWITCH-SPST: Momentary Switch (Pushbutton) - SPST Normally-open (NO) SPST momentary switches (buttons, pushbuttons). Variants PTH-12MM - 12mm square, through-hole Momentary Pushbutton Switch - 12mm Square <https://www.sparkfun.com/products/9190> (COM-09190) PTH-6.0MM, PTH-6.0MM-KIT - 6.0mm square, through-hole Mini Pushbutton Switch <https://www.sparkfun.com/products/97> (COM-00097) KIT package intended for soldering kit's - only one side of pads' copper is exposed. PTH-RIGHT-ANGLE-KIT - Right-angle, through-hole Right Angle Tactile Button <https://www.sparkfun.com/products/10791> - Used on SparkFun BigTime Watch Kit <https://www.sparkfun.com/products/11734> SMD-12MM - 12mm square, surface-mount Tactile Button - SMD (12mm) <https://www.sparkfun.com/products/12993> (COM-12993) Used on SparkFun PicoBoard <https://www.sparkfun.com/products/11888> SMD-4.5MM - 4.5mm Square Trackball Switch Used on SparkFun Blackberry Trackballer Breakout <https://www.sparkfun.com/products/13169> SMD-4.6MMX2.8MM - 4.60mm x 2.80mm, surface mount Used on SparkFun SAMD21 Mini Breakout <https://www.sparkfun.com/products/13664> SMD-5.2MM, SMD-5.2-REDUNDANT - 5.2mm square, surface-mount Mini Pushbutton Switch - SMD <https://www.sparkfun.com/products/8720> (COM-08720) Used on Arduino Pro Mini <https://www.sparkfun.com/products/11114> REDUNDANT package connects both switch circuits together SMD-6.0X3.5MM - 6.0 x 3.5mm, surface mount Momentary Reset Switch SMD <https://www.sparkfun.com/products/8229> (COM-08229) SMD-6.2MM-TALL - 6.2mm square, surface mount Tactile Button - SMD (6mm) <https://www.sparkfun.com/products/12992> Used on SparkFun Digital Sandbox <https://www.sparkfun.com/products/12651> SMD-RIGHT-ANGLE - Right-angle, surface mount Used on SparkFun Block for Intel® Edison - Arduino <https://www.sparkfun.com/products/13036>; PROD_ID: SWCH-11966; SF_SKU: COM-12992
U1-U6 = Volume_V1:PCF8575TS/1; BUILT_BY: EMA_UL_Team; MANUFACTURER_PART_NUMBER: PCF8575TS/1; SOURCELIBRARY: NXP_2011-11-10; VENDOR: NXP
U$1 U$3 = Volume_V1:ENCODER
U$2 = TEENSY 4.0:TEENSY_4.0
X1 = adafruit:USB-A: USB type A 'plug' Used for things that can directly connect to a USB port, say USB key